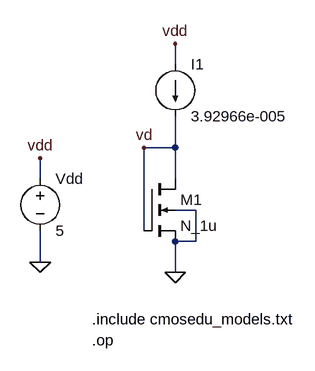
[diagram p0: schematic pt2.asc]
pt2.asc, the LTspice schematic file:
Version 4
SHEET 1 880 680
WIRE 176 -48 176 -80
WIRE 176 80 176 32
WIRE 176 80 128 80
WIRE -32 128 -32 96
WIRE 176 128 176 80
WIRE 208 176 176 176
WIRE 128 208 128 80
WIRE 208 224 208 176
WIRE 208 224 176 224
WIRE -32 256 -32 208
WIRE 176 272 176 224
FLAG 176 272 0
FLAG 176 -80 vdd
FLAG -32 256 0
FLAG -32 96 vdd
FLAG 128 80 vd
SYMBOL nmos4 128 128 R0
SYMATTR InstName M1
SYMATTR Value N_1u
SYMATTR Value2 l=1.5u w=3u
SYMBOL current 176 -48 R0
WINDOW 123 0 0 Left 2
WINDOW 39 0 0 Left 2
SYMATTR InstName I1
SYMATTR Value 3.92966e-005
SYMBOL voltage -32 112 R0
WINDOW 123 0 0 Left 2
WINDOW 39 0 0 Left 2
SYMATTR InstName Vdd
SYMATTR Value 5
TEXT 48 344 Left 2 !.include cmosedu_models.txt
TEXT 48 376 Left 2 !.op

The netlist it stands for:
* pt2.asc
M1 vd vd 0 0 N_1u l=1.5u w=3u
I1 vdd vd 3.92966e-005
Vdd vdd 0 5
.model NMOS NMOS
.model PMOS PMOS
.lib standard.mos
.include cmosedu_models.txt
.op
.backanno
.end

* Results of the author's LTspice run, read from the files saved beside the schematic
* Operating Point:
*   V(vd) = 1.5 V
*   V(vdd) = 5 V
*   Id(M1) = 39.3 µA
*   Ig(M1) = 0 A
*   Ib(M1) = -1.51 pA
*   Is(M1) = -39.3 µA
*   I(I1) = 39.3 µA
*   I(Vdd) = -39.3 µA
* From the log:
*   Semiconductor Device Operating Points:
*                           --- MOSFET Transistors ---
*   Name:          m1
*   Model:        n_1u
*   Id:          3.93e-05
*   Vgs:         1.50e+00
*   Vds:         1.50e+00
*   Vbs:         0.00e+00
*   Vth:         8.90e-01
*   Vdsat:       4.74e-01
*   Gm:          1.01e-04
*   Gds:         4.28e-06
*   Gmb:         3.45e-05
*   Cbd:         0.00e+00
*   Cbs:         0.00e+00
*   Cgsov:       6.00e-16
*   Cgdov:       6.00e-16
*   Cgbov:       1.30e-16
*   Cgs:         4.49e-15
*   Cgd:         0.00e+00
*   Cgb:         0.00e+00